# EAGLE schematic relay_dip_v02 (EAGLE 6.5.0)
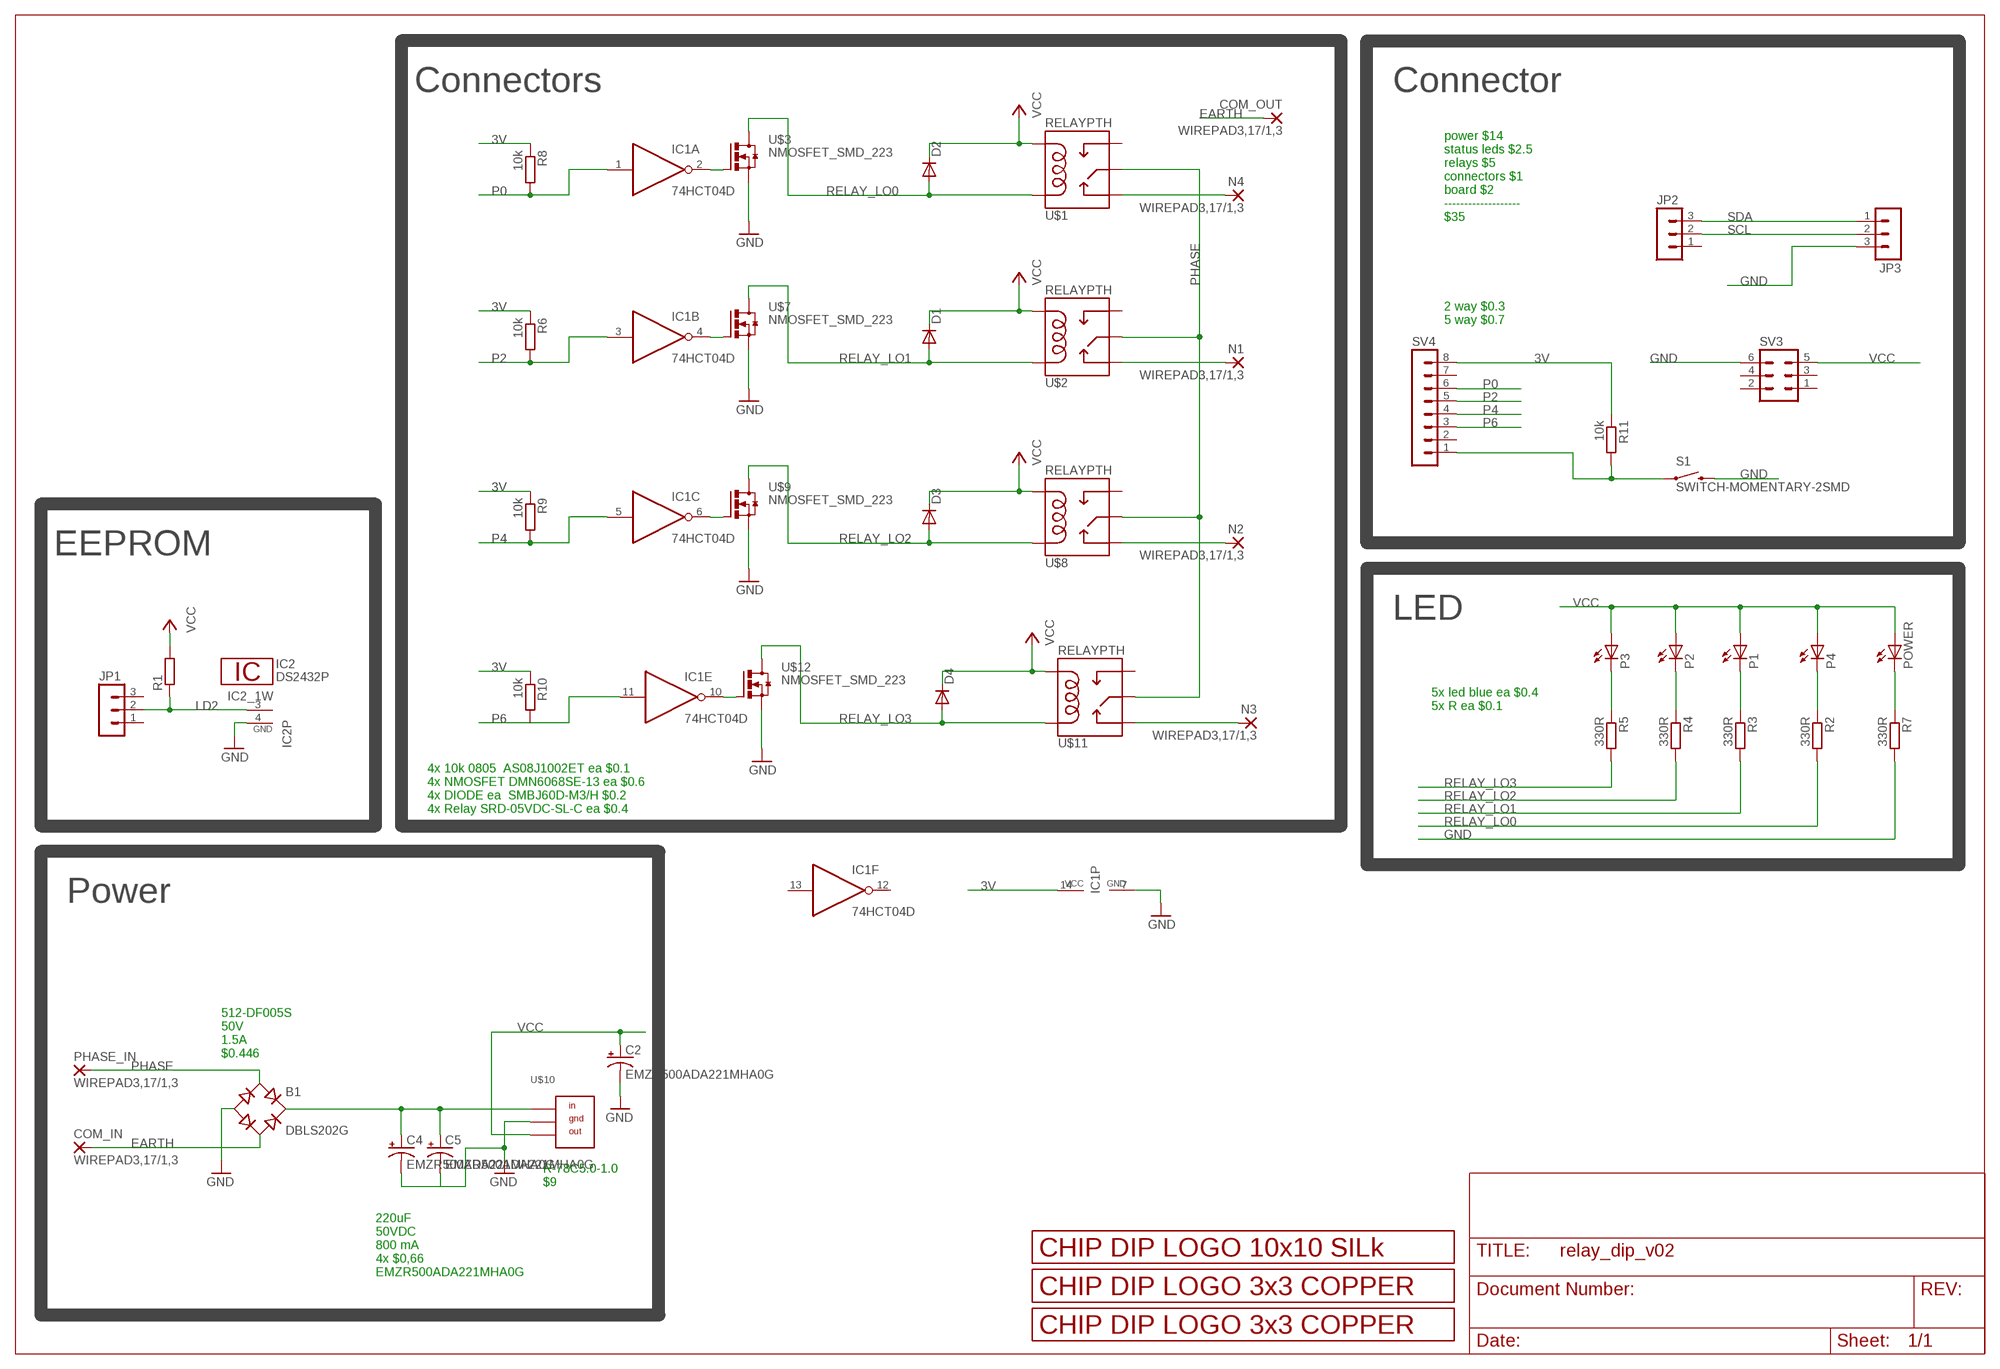
[diagram p0: schematic, sheet 1]

## Parts
B1  DBLS202G  [DBS]
C2  EMZR500ADA221MHA0G  CPOL-US150CLZ-0810  [150CLZ-0810]
C4  EMZR500ADA221MHA0G  CPOL-US150CLZ-0810  [150CLZ-0810]
C5  EMZR500ADA221MHA0G  CPOL-US150CLZ-0810  [150CLZ-0810]
COM_IN  WIREPAD3,17/1,3  [3,17/1,3]
COM_OUT  WIREPAD3,17/1,3  [3,17/1,3]
D1  DIODE-SMB  [SMB]
D2  DIODE-SMB  [SMB]
D3  DIODE-SMB  [SMB]
D4  DIODE-SMB  [SMB]
IC1  74HCT04D  [SO14]
IC2  DS2432P  [TSOC6]
JP1  MA03-1  [MA03-1]
JP2  MA03-1  [MA03-1]
JP3  MA03-1  [MA03-1]
N1  WIREPAD3,17/1,3  [3,17/1,3]
N2  WIREPAD3,17/1,3  [3,17/1,3]
N3  WIREPAD3,17/1,3  [3,17/1,3]
N4  WIREPAD3,17/1,3  [3,17/1,3]
P1  LEDCHIP-LED0805  [CHIP-LED0805]
P2  LEDCHIP-LED0805  [CHIP-LED0805]
P3  LEDCHIP-LED0805  [CHIP-LED0805]
P4  LEDCHIP-LED0805  [CHIP-LED0805]
PHASE_IN  WIREPAD3,17/1,3  [3,17/1,3]
POWER  LEDCHIP-LED0805  [CHIP-LED0805]
R1  R-EU_R0805  [R0805]
R2  330R  R-EU_R0805  [R0805]
R3  330R  R-EU_R0805  [R0805]
R4  330R  R-EU_R0805  [R0805]
R5  330R  R-EU_R0805  [R0805]
R6  10k  R-EU_R0805  [R0805]
R7  330R  R-EU_R0805  [R0805]
R8  10k  R-EU_R0805  [R0805]
R9  10k  R-EU_R0805  [R0805]
R10  10k  R-EU_R0805  [R0805]
R11  10k  R-EU_R0805  [R0805]
S1  SWITCH-MOMENTARY-2SMD  [TACTILE-SWITCH-SMD]
SV3  MA03-2  [MA03-2]
SV4  MA08-1  [MA08-1]
U$1  RELAYPTH  [SRD-05VDC-SL-C]
U$2  RELAYPTH  [SRD-05VDC-SL-C]
U$3  NMOSFET_SMD_223  [SOT223]
U$4  LOGO_3X3_COPPER  [LOGO_3X3_COPPER]
U$5  LOGO_10X10_SILK  [LOGO_10X10_SILK]
U$6  LOGO_3X3_COPPER  [LOGO_3X3_COPPER]
U$7  NMOSFET_SMD_223  [SOT223]
U$8  RELAYPTH  [SRD-05VDC-SL-C]
U$9  NMOSFET_SMD_223  [SOT223]
U$10  R-7805-1.0  [SIP3]
U$11  RELAYPTH  [SRD-05VDC-SL-C]
U$12  NMOSFET_SMD_223  [SOT223]

## Nets
3V: IC1.14(P:VCC) R6.1 R8.1 R9.1 R10.1 R11.1 SV4.8
EARTH: B1.AC2 COM_IN.1(P) COM_OUT.1(P)
GND: B1.- C2.- C4.- C5.- IC1.7(P:GND) IC2.4(GND) JP3.3 R7.2 S1.3 SV3.6 U$3.3(S) U$7.3(S) U$9.3(S) U$10.GND U$12.3(S)
LD2: IC2.3(1W) JP1.2 R1.1
N$1: R11.2 S1.1 SV4.1
N$2: IC1.2(A:O) U$3.1(G)
N$3: P4.C R2.1
N$4: P1.C R3.1
N$5: B1.+ C4.+ C5.+ U$10.IN
N$7: IC1.4(B:O) U$7.1(G)
N$8: P2.C R4.1
N$9: IC1.6(C:O) U$9.1(G)
N$10: P3.C R5.1
N$11: IC1.10(E:O) U$12.1(G)
N$29: POWER.C R7.1
NCL: N4.1(P) U$1.SWCLOSED(SWCLOSE)
NCL1: N1.1(P) U$2.SWCLOSED(SWCLOSE)
NCL2: N2.1(P) U$8.SWCLOSED(SWCLOSE)
NCL3: N3.1(P) U$11.SWCLOSED(SWCLOSE)
P0: IC1.1(A:I) R8.2 SV4.6
P2: IC1.3(B:I) R6.2 SV4.5
P4: IC1.5(C:I) R9.2 SV4.4
P6: IC1.11(E:I) R10.2 SV4.3
PHASE: B1.AC1 PHASE_IN.1(P) U$1.SWCOMMON U$2.SWCOMMON U$8.SWCOMMON U$11.SWCOMMON
RELAY_LO0: D2.A R2.2 U$1.COIL1 U$3.2(D) U$3.4(D)
RELAY_LO1: D1.A R3.2 U$2.COIL1 U$7.2(D) U$7.4(D)
RELAY_LO2: D3.A R4.2 U$8.COIL1 U$9.2(D) U$9.4(D)
RELAY_LO3: D4.A R5.2 U$11.COIL1 U$12.2(D) U$12.4(D)
SCL: JP2.2 JP3.2
SDA: JP2.3 JP3.1
VCC: C2.+ D1.C D2.C D3.C D4.C P1.A P2.A P3.A P4.A POWER.A R1.2 SV3.5 U$1.COIL0 U$2.COIL0 U$8.COIL0 U$10.OUT U$11.COIL0
Unconnected: IC1.8(D:O) IC1.9(D:I) IC1.12(F:O) IC1.13(F:I) JP1.1 JP1.3 JP2.1 SV3.1 SV3.2 SV3.3 SV3.4 SV4.2 SV4.7 U$1.SWOPEN U$2.SWOPEN U$8.SWOPEN U$11.SWOPEN

## Notes on the sheet
- Connectors | Connector
- power $14
  status leds $2.5
  relays $5
  connectors $1
  board $2
  -------------------
  $35
- 2 way $0.3
  5 way $0.7
- EEPROM
- LED
- 5x led blue ea $0.4
  5x R ea $0.1
- 4x 10k 0805  AS08J1002ET ea $0.1
  4x NMOSFET DMN6068SE-13 ea $0.6
  4x DIODE ea  SMBJ60D-M3/H $0.2
  4x Relay SRD-05VDC-SL-C ea $0.4
- Power
- 512-DF005S
  50V
  1.5A
  $0.446
- R-78C5.0-1.0
  $9
- 220uF
  50VDC
  800 mA
  4x $0,66
  EMZR500ADA221MHA0G

## Library data of the parts
B1 = rectifier:DB?*G: Single Phase 1.0 AMP Glass Passivated Bridge Rectifier Taiwan Semiconductor Co.,Ltd. - TSC Source: http://www.taiwansemi.com/TSCbig5/ezcatfiles/cust/img/img/db101g.pdf http://www.ts.com.tw/db/pictures/modules/PDT/PDT060207001/DBLS201G.pdf
C2 C4 C5 = rcl:CPOL-US: POLARIZED CAPACITOR, American symbol
COM_IN COM_OUT N1-N4 PHASE_IN = wirepad:WIREPAD: Wire PAD connect wire on PCB
D1-D4 = diode:DIODE-: DIODE
IC1 = 74xx-eu:74*04: Hex INVERTER
IC2 = 1wire:DS2432: 1024-Bit Protected EEPROM with SHA-1 Engine This chip is a cryptographic device, providing 1024 Bits of EEPROM memory which may be written only after supplying the correct 64 bit secret. the secret cannot be read back from the device. The other features of this chip are like the DS2431. Please note the SHA-1 hash algorithm is considered weak if the data is not properly "padded". If you don't understand anything of this, don't use this chip. Author: Jan Kandziora <jjj@gmx.de>
JP1-JP3 = con-lstb:MA03-1: PIN HEADER; OC_FARNELL: unknown; OC_NEWARK: unknown
P1-P4 POWER = led:LED: LED OSRAM: - CHIPLED LG R971, LG N971, LY N971, LG Q971, LY Q971, LO R971, LY R971 LH N974, LH R974 LS Q976, LO Q976, LY Q976 LO Q996 - Hyper CHIPLED LW Q18S LB Q993, LB Q99A, LB R99A - SideLED LS A670, LO A670, LY A670, LG A670, LP A670 LB A673, LV A673, LT A673, LW A673 LH A674 LY A675 LS A676, LA A676, LO A676, LY A676, LW A676 LS A679, LY A679, LG A679 - Hyper Micro SIDELED® LS Y876, LA Y876, LO Y876, LY Y876 LT Y87S - SmartLED LW L88C, LW L88S LB L89C, LB L89S, LG L890 LS L89K, LO L89K, LY L89K LS L896, LA L896, LO L896, LY L896 - TOPLED LS T670, LO T670, LY T670, LG T670, LP T670 LSG T670, LSP T670, LSY T670, LOP T670, LYG T670 LG T671, LOG T671, LSG T671 LB T673, LV T673, LT T673, LW T673 LH T674 LS T676, LA T676, LO T676, LY T676, LB T676, LH T676, LSB T676, LW T676 LB T67C, LV T67C, LT T67C, LS T67K, LO T67K, LY T67K, LW E67C LS E67B, LA E67B, LO E67B, LY E67B, LB E67C, LV E67C, LT E67C LW T67C LS T679, LY T679, LG T679 LS T770, LO T770, LY T770, LG T770, LP T770 LB T773, LV T773, LT T773, LW T773 LH T774 LS E675, LA E675, LY E675, LS T675 LS T776, LA T776, LO T776, LY T776, LB T776 LHGB T686 LT T68C, LB T68C - Hyper Mini TOPLED® LB M676 - Mini TOPLED Santana® LG M470 LS M47K, LO M47K, LY M47K Source: http://www.osram.convergy.de LUXEON: - LUMILED® LXK2-PW12-R00, LXK2-PW12-S00, LXK2-PW14-U00, LXK2-PW14-V00 LXK2-PM12-R00, LXK2-PM12-S00, LXK2-PM14-U00 LXK2-PE12-Q00, LXK2-PE12-R00, LXK2-PE12-S00, LXK2-PE14-T00, LXK2-PE14-U00 LXK2-PB12-K00, LXK2-PB12-L00, LXK2-PB12-M00, LXK2-PB14-N00, LXK2-PB14-P00, LXK2-PB14-Q00 LXK2-PR12-L00, LXK2-PR12-M00, LXK2-PR14-Q00, LXK2-PR14-R00 LXK2-PD12-Q00, LXK2-PD12-R00, LXK2-PD12-S00 LXK2-PH12-R00, LXK2-PH12-S00 LXK2-PL12-P00, LXK2-PL12-Q00, LXK2-PL12-R00 Source: www.luxeon.com KINGBRIGHT: KA-3528ASYC Source: www.kingbright.com
R1-R11 = rcl:R-EU_: RESISTOR, European symbol
S1 = SparkFun-Electromechanical:SWITCH-MOMENTARY-2: Various NO switches- pushbuttons, reed, etc; PROD_ID: SWCH-08247
SV3 = con-lstb:MA03-2: PIN HEADER; OC_FARNELL: unknown; OC_NEWARK: unknown
SV4 = con-lstb:MA08-1: PIN HEADER; OC_FARNELL: unknown; OC_NEWARK: unknown
U$1 U$2 U$8 U$11 = SRD-05VDC-SL-C:RELAY: SPDT relay (COM-00101)
U$3 U$7 U$9 U$12 = transistor-power:NMOSFET_SMD_223
U$4 U$6 = logo:LOGO_3X3_COPPER
U$5 = logo:LOGO_10X10_SILK
U$10 = Kolja:R-7805-1.0